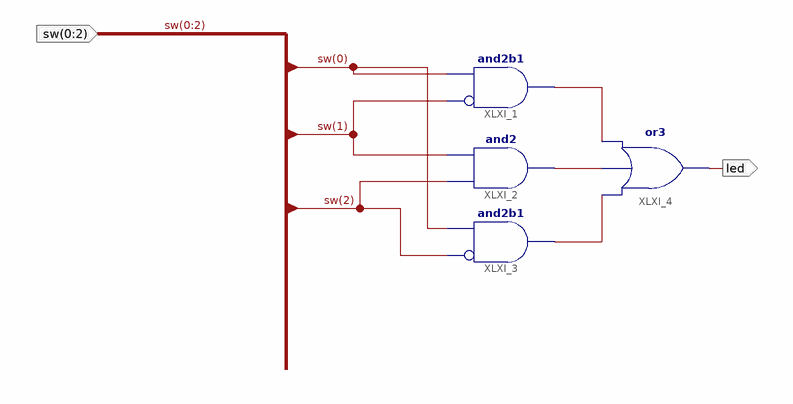
[diagram p0: schematic sheet 1]
// Xilinx ISE schematic scheme.sch (spartan6) as structural Verilog: 4 symbols, 2 ports
module scheme (
  input  [0:2] sw,
  output led
);

  wire XLXN_10, XLXN_11, XLXN_12;

  and XLXI_1 (XLXN_10, ~sw[1], sw[0]);  // and2b1
  and XLXI_2 (XLXN_11, sw[2], sw[1]);
  and XLXI_3 (XLXN_12, ~sw[2], sw[0]);  // and2b1
  or XLXI_4 (led, XLXN_12, XLXN_11, XLXN_10);
endmodule
